# Altium schematic sheet fpga_gtp.SchDoc: FPGA GTP transceivers
size 297 x 209 mm; CheckedBy: MC, TW, EB; CompanyName: CERN; DrawnBy: Greg Kasprowicz; Organization: CERN; Address1: European Organization for Nuclear Research; Address2: CH-1211 Geneve 23 - Switzerland; DocumentNumber: 4; Revision: -; SheetNumber: 4; SheetTotal: 17; EDA_Number: EDA-02189-V4-0; Projet: Simple PCIe FMC Carrier Board; ModifiedBy: TW, MC; CreateDate: 10/07/2010; CheckedDate: 11/05/2011; Title2: SATA connectors; DivGrp: BE-CO; Designer: GK, MC, TW, EB, PAS; DocumentName: fpga_gtp.SchDoc; ModifiedDate: -
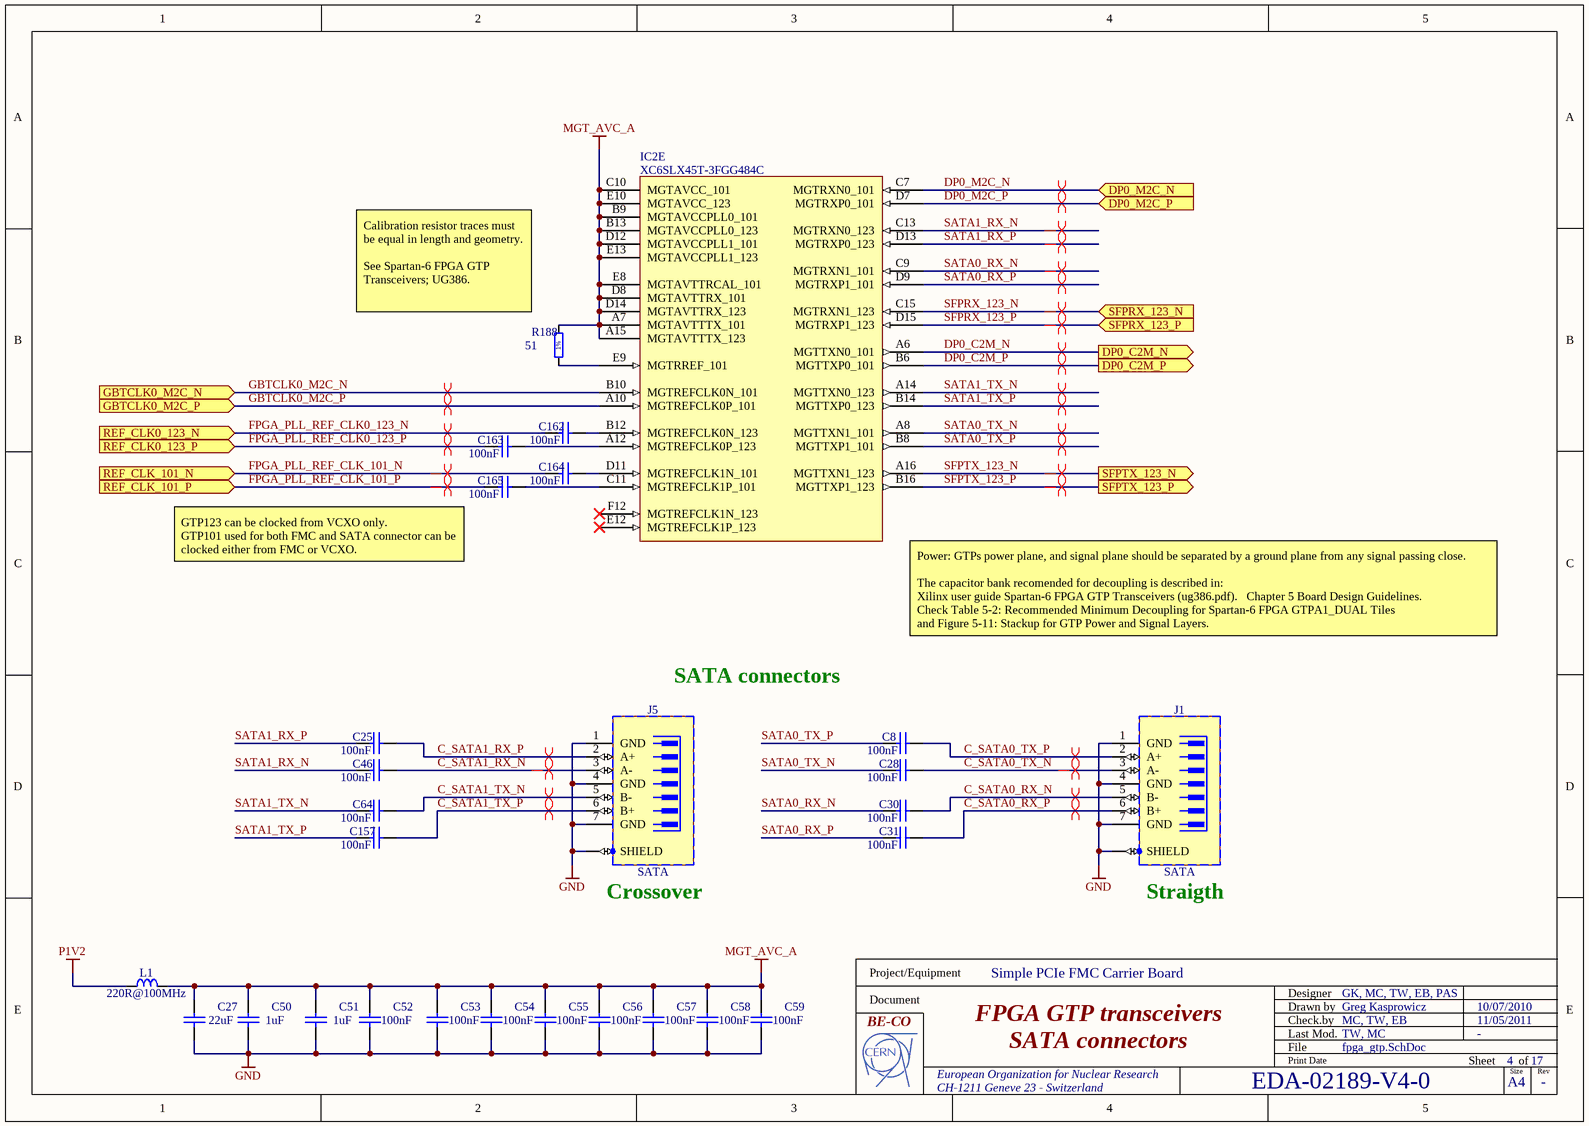
[diagram p0: fpga_gtp.SchDoc]

## Parts
C8  100nF  [CAPC1005X55N]
C25  100nF  [CAPC1005X55N]
C27  22uF  [CAPC3216X180N]
C28  100nF  [CAPC1005X55N]
C30  100nF  [CAPC1005X55N]
C31  100nF  [CAPC1005X55N]
C46  100nF  [CAPC1005X55N]
C50  1uF  [CAPC1608X87N]
C51  1uF  [CAPC1608X87N]
C52  100nF  [CAPC1005X55N]
C53  100nF  [CAPC1005X55N]
C54  100nF  [CAPC1005X55N]
C55  100nF  [CAPC1005X55N]
C56  100nF  [CAPC1005X55N]
C57  100nF  [CAPC1005X55N]
C58  100nF  [CAPC1005X55N]
C59  100nF  [CAPC1005X55N]
C64  100nF  [CAPC1005X55N]
C157  100nF  [CAPC1005X55N]
C162  100nF  [CAPC1005X55N]
C163  100nF  [CAPC1005X55N]
C164  100nF  [CAPC1005X55N]
C165  100nF  [CAPC1005X55N]
IC2  XC6SLX45T-3FGG484C  [BGA484C100P22X22_2300X2300X260]  (part E of 9)
J1  SATA  [3M_5607-4200-SH]
J5  SATA  [3M_5607-4200-SH]
L1  220R@100MHz  [INDC2012X105N]
R188  51  [RESC1005X40N]

## Ports
DP0_C2M_N (out), DP0_C2M_P (out), DP0_M2C_N (in), DP0_M2C_P (in), GBTCLK0_M2C_N (in), GBTCLK0_M2C_P (in), REF_CLK0_123_N (in), REF_CLK0_123_P (in), REF_CLK_101_N (in), REF_CLK_101_P (in), SFPRX_123_N (in), SFPRX_123_P (in), SFPTX_123_N (out), SFPTX_123_P (out)

## Nets
GND: C27.1 C50.1 C51.1 C52.1 C53.1 C54.1 C55.1 C56.1 C57.1 C58.1 C59.1 J1.1(GND) J1.4(GND) J1.7(GND) J1.8(SHIELD) J5.1(GND) J5.4(GND) J5.7(GND) J5.8(SHIELD)
MGT_AVC_A: C27.2 C50.2 C51.2 C52.2 C53.2 C54.2 C55.2 C56.2 C57.2 C58.2 C59.2 IC2.A7(MGTAVTTTX_101) IC2.A15(MGTAVTTTX_123) IC2.B9(MGTAVCCPLL0_101) IC2.B13(MGTAVCCPLL0_123) IC2.C10(MGTAVCC_101) IC2.D8(MGTAVTTRX_101) IC2.D12(MGTAVCCPLL1_101) IC2.D14(MGTAVTTRX_123) IC2.E8(MGTAVTTRCAL_101) IC2.E10(MGTAVCC_123) IC2.E13(MGTAVCCPLL1_123) L1.2 R188.2
P1V2: L1.1
C_SATA0_RX_N: C30.2 J1.5(B-)
C_SATA0_RX_P: C31.2 J1.6(B+)
C_SATA0_TX_N: C28.2 J1.3(A-)
C_SATA0_TX_P: C8.2 J1.2(A+)
C_SATA1_RX_N: C46.2 J5.3(A-)
C_SATA1_RX_P: C25.2 J5.2(A+)
C_SATA1_TX_N: C64.2 J5.5(B-)
C_SATA1_TX_P: C157.2 J5.6(B+)
DP0_C2M_N: IC2.A6(MGTTXN0_101) ; port DP0_C2M_N
DP0_C2M_P: IC2.B6(MGTTXP0_101) ; port DP0_C2M_P
DP0_M2C_N: IC2.C7(MGTRXN0_101) ; port DP0_M2C_N
DP0_M2C_P: IC2.D7(MGTRXP0_101) ; port DP0_M2C_P
FPGA_PLL_REF_CLK0_123_N: C162.1 ; port REF_CLK0_123_N
FPGA_PLL_REF_CLK0_123_P: C163.1 ; port REF_CLK0_123_P
FPGA_PLL_REF_CLK_101_N: C164.1 ; port REF_CLK_101_N
FPGA_PLL_REF_CLK_101_P: C165.1 ; port REF_CLK_101_P
GBTCLK0_M2C_N: IC2.B10(MGTREFCLK0N_101) ; port GBTCLK0_M2C_N
GBTCLK0_M2C_P: IC2.A10(MGTREFCLK0P_101) ; port GBTCLK0_M2C_P
SATA0_RX_N: C30.1 IC2.C9(MGTRXN1_101)
SATA0_RX_P: C31.1 IC2.D9(MGTRXP1_101)
SATA0_TX_N: C28.1 IC2.A8(MGTTXN1_101)
SATA0_TX_P: C8.1 IC2.B8(MGTTXP1_101)
SATA1_RX_N: C46.1 IC2.C13(MGTRXN0_123)
SATA1_RX_P: C25.1 IC2.D13(MGTRXP0_123)
SATA1_TX_N: C64.1 IC2.A14(MGTTXN0_123)
SATA1_TX_P: C157.1 IC2.B14(MGTTXP0_123)
SFPRX_123_N: IC2.C15(MGTRXN1_123) ; port SFPRX_123_N
SFPRX_123_P: IC2.D15(MGTRXP1_123) ; port SFPRX_123_P
SFPTX_123_N: IC2.A16(MGTTXN1_123) ; port SFPTX_123_N
SFPTX_123_P: IC2.B16(MGTTXP1_123) ; port SFPTX_123_P
NetC162_2: C162.2 IC2.B12(MGTREFCLK0N_123)
NetC163_2: C163.2 IC2.A12(MGTREFCLK0P_123)
NetC164_2: C164.2 IC2.D11(MGTREFCLK1N_101)
NetC165_2: C165.2 IC2.C11(MGTREFCLK1P_101)
NetIC2_E9: IC2.E9(MGTRREF_101) R188.1

Not connected (* = marked no-connect by the designer): IC2 E12(MGTREFCLK1P_123)* F12(MGTREFCLK1N_123)*

## Layout directives
differential pair: C_SATA0_RX_N, C_SATA0_RX_P, C_SATA0_TX_N, C_SATA0_TX_P, C_SATA1_RX_N, C_SATA1_RX_P, C_SATA1_TX_N, C_SATA1_TX_P, DP0_C2M_N, DP0_C2M_P, DP0_M2C_N, DP0_M2C_P, FPGA_PLL_REF_CLK0_123_N, FPGA_PLL_REF_CLK0_123_P, FPGA_PLL_REF_CLK_101_N, FPGA_PLL_REF_CLK_101_P, GBTCLK0_M2C_N, GBTCLK0_M2C_P, SATA0_RX_N, SATA0_RX_P, SATA0_TX_N, SATA0_TX_P, SATA1_RX_N, SATA1_RX_P, SATA1_TX_N, SATA1_TX_P, SFPRX_123_N, SFPRX_123_P, SFPTX_123_N, SFPTX_123_P

## Notes on the sheet
- (near R188) Calibration resistor traces must be equal in length and geometry.
  See Spartan-6 FPGA GTP Transceivers; UG386.
- (near C165) GTP123 can be clocked from VCXO only.
  GTP101 used for both FMC and SATA connector can be clocked either from FMC or VCXO.
- (near IC2) Power: GTPs power plane, and signal plane should be separated by a ground plane from any signal passing close.
  The capacitor bank recomended for decoupling is described in:
  Xilinx user guide Spartan-6 FPGA GTP Transceivers (ug386.pdf).   Chapter 5 Board Design Guidelines.
  Check Table 5-2: Recommended Minimum Decoupling for Spartan-6 FPGA GTPA1_DUAL Tiles
  and Figure 5-11: Stackup for GTP Power and Signal Layers.
- SATA connectors
- (near J5) Crossover
- (near J1) Straigth
- Project/Equipment
- Document
- Designer
- Drawn by
- Check.by
- File
- Last Mod.
- Print Date
- Sheet
- Size
- A4
- of
- Rev
- (in symbol R0402_51R_1%_0.0625W_100PPM) 1%

## Library data of the parts
C8 C25 C28 C30 C31 C46 C52-C59 C64 C157 C162-C165 = CC0402_100NF_16V_10%_X7R: Non-polarised capacitor; Part Description: SMD Multilayer Chip Ceramic Capacitor; Manufacturer: GENERIC; Manufacturer1 Part Number: 223878715649; Voltage: 16V; TC: X7R; Tolerance: ±10%; Table: Capacitors SMD; Part Number: CC0402_100NF_16V_10%_X7R; Component Kind: Standard; Component Type: Standard; Pin Count: 2; Value: 100nF; Status: Not Recommended; Manufacturer Part Number: CC0402_100NF_16V_10%_X7R; Case: 0402; Mounted: Yes; Socket: No; SMD: Yes; Manufacturer1 Example: PHYCOMP; Manufacturer1 ComponentHeight: 0.55mm; HelpURL: \\cern.ch\dfs\Applications\Altium\Datasheets\CC0402_X7R_PHYCOMP.pdf; Author: CERN DEM JLC; CreateDate: 03/12/2007; LatestRevisionDate: 03/12/2007
C27 = CC1206_22UF_10V_10%_X7R: Non-polarised capacitor; Part Description: SMD Multilayer Chip Ceramic Capacitor; Manufacturer: GENERIC; Manufacturer1 Part Number: GRM31CR71A226KE15L; Voltage: 10V; TC: X7R; Tolerance: ±10%; Table: Capacitors SMD; Part Number: CC1206_22UF_10V_10%_X7R; Component Kind: Standard; Component Type: Standard; Pin Count: 2; Value: 22uF; Status: Preferred; Manufacturer Part Number: CC1206_22UF_10V_10%_X7R; Case: 1206; Mounted: Yes; Socket: No; SMD: Yes; Manufacturer1 Example: MURATA; Manufacturer1 ComponentHeight: 1.8mm; HelpURL: \\cern.ch\dfs\Applications\Altium\Datasheets\CC1206_X7R_MURATA_GRM-HI-CAP.pdf; Author: CERN DEM JLC; CreateDate: 2010-06-08; LatestRevisionDate: 2010-06-08
C50 C51 = CC0603_1UF_16V_10%_X7R: Non-polarised capacitor; Part Description: SMD Multilayer Chip Ceramic Capacitor; Manufacturer: GENERIC; Manufacturer1 Part Number: 223824613663; Voltage: 16V; TC: X7R; Tolerance: ±10%; Table: Capacitors SMD; Part Number: CC0603_1UF_16V_10%_X7R; Component Kind: Standard; Component Type: Standard; Pin Count: 2; Value: 1uF; Status: Preferred; Manufacturer Part Number: CC0603_1uF_16V_10%_X7R; Case: 0603; Mounted: Yes; Socket: No; SMD: Yes; Manufacturer1 Example: PHYCOMP; Manufacturer1 ComponentHeight: 0.87mm; HelpURL: \\cern.ch\dfs\Applications\Altium\Datasheets\CC0805_X5R_PHYCOMP_HC.pdf; Author: CERN DEM JLC; CreateDate: 03/12/2007; LatestRevisionDate: 03/12/2007
IC2 = XC6SLX45T-3FGG484C: Spartan-6 LXT 1.2V FPGA, 296 User I/Os, 484-Ball Fine-Pitch BGA (1.0mm Pitch), Speed Grade 3, Commercial Grade, Pb-Free; Manufacturer: XILINX; Table: Logic; Part Number: XC6SLX45T-3FGG484C; Component Kind: Standard; Component Type: Standard; Device: XC6SLX45T-3FGG484C; PackageDescription: BGA,1.00mm pitch,square;484 pin,22 columns X 22 rows,23.00mm X 23.00mm X 2.60mm H; Part Description: Spartan-6 LXT 1.2V FPGA, 296 User I/Os, 484-Ball Fine-Pitch BGA (1.0mm Pitch), Speed Grade 3, Commercial Grade, Pb-Free; Manufacturer Part Number: XC6SLX45T-3FGG484C; Pin Count: 484; Case: BGA484; Mounted: Yes; Socket: No; SMD: Yes; ComponentHeight: 2.6mm; HelpURL: \\cern.ch\dfs\Applications\Altium\Datasheets\XC6SLX45T-3FGG484C.pdf; ComponentLink1URL: \\cern.ch\dfs\Applications\Altium\Datasheets\XC6SLX45T-3FGG484C_Package-Pinouts.pdf; ComponentLink1Description: Package/Pinouts; Author: CERN DEM JLC; CreateDate: 2010-07-08; LatestRevisionDate: 2010-07-08
J1 J5 = 3M_5607-4200-SH: 7 Pin + 1 Shield SATA Receptacle; Part Description: Signal Plug, Surfacemount, Right Angle,  Serial Advanced Technology Attachment (SATA) Connector, 5607 Series; Manufacturer: 3M; Part Number: 3M_5607-4200-SH; Component Kind: Standard; Component Type: Standard; Pin Count: 8; Family: SATA; Mounted: Yes; Socket: No; SMD: Yes; Status: None; Manufacturer Part Number: 5607-4200-SH; ComponentHeight: 4mm; HelpURL: \\cern.ch\dfs\Applications\Altium\Datasheets\3M_5607-4200-SH.pdf; Author: CERN DEM JLC; CreateDate: 14/02/2011; LatestRevisionDate: 31/05/2011; Table: 3M
L1 = IND0805_MURATA_BLM21PG221SN1D: Inductor; Part Description: SMD EMIFIL Suppression Chip Bead Ferrite; Manufacturer: MURATA; Power: 2A; Resistance: 0.05R; Tolerance: ±25%; Table: Inductors SMD; Part Number: IND0805_MURATA_BLM21PG221SN1D; Component Kind: Standard; Component Type: Standard; Pin Count: 2; Value: 220R@100MHz; Status: None; Manufacturer Part Number: BLM21PG221SN1D; Case: 0805; Mounted: Yes; Socket: No; SMD: Yes; ComponentHeight: 1.05mm; HelpURL: \\cern.ch\dfs\Applications\Altium\Datasheets\IND0402_MURATA_BLM21P.pdf; Author: CERN DEM JLC; CreateDate: 25/01/2010; LatestRevisionDate: 25/01/2010
R188 = R0402_51R_1%_0.0625W_100PPM: Resistor - 1%; Part Description: General Purpose Thick Film Chip Resistor; Manufacturer: GENERIC; Manufacturer1 Part Number: 232270675109; TC: ±100ppm/°C; Table: Resistors SMD; Part Number: R0402_51R_1%_0.0625W_100PPM; Component Kind: Standard; Component Type: Standard; Pin Count: 2; Value: 51; Status: Not recommended; Power: 0.0625W; Tolerance: ±1%; Manufacturer Part Number: R0402_51R_1%_0.0625W_100PPM; Case: 0402; Mounted: Yes; Socket: No; SMD: Yes; Manufacturer1 Example: PHYCOMP; Manufacturer1 ComponentHeight: 0.4mm; HelpURL: \\cern.ch\dfs\Applications\Altium\Datasheets\R0402_Phycomp_RC0402.pdf; Author: CERN DEM JLC; CreateDate: 03/12/2007; LatestRevisionDate: 13/03/2008